# Altium schematic sheet Sch_Add.SchDoc
size A
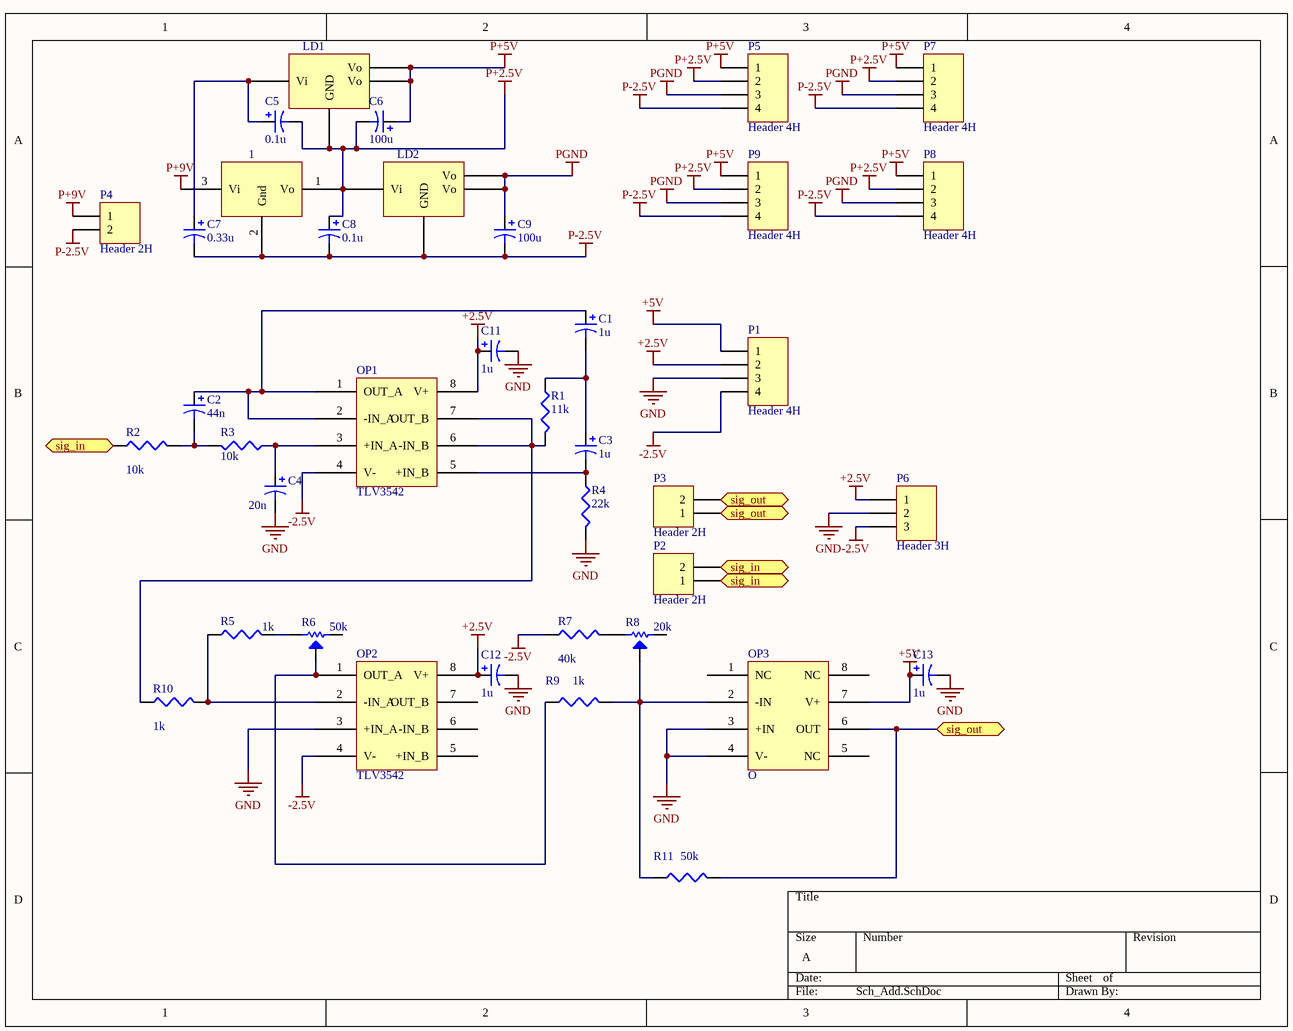
[diagram p0: Sch_Add.SchDoc]

## Parts
1  7805  [TO-92]  (value not drawn)
C1  value 1u  [C0805]  (hidden comment: Cap Pol3)
C2  value 44n  [C0805]  (hidden comment: Cap Pol3)
C3  value 1u  [C0805]  (hidden comment: Cap Pol3)
C4  value 20n  [C0805]  (hidden comment: Cap Pol3)
C5  value 0.1u  [C0805]  (hidden comment: Cap Pol3)
C6  value 100u  [C0805]  (hidden comment: Cap Pol3)
C7  value 0.33u  [C0805]  (hidden comment: Cap Pol3)
C8  value 0.1u  [C0805]  (hidden comment: Cap Pol3)
C9  value 100u  [C0805]  (hidden comment: Cap Pol3)
C11  value 1u  [C0805]  (hidden comment: Cap Pol3)
C12  value 1u  [C0805]  (hidden comment: Cap Pol3)
C13  value 1u  [C0805]  (hidden comment: Cap Pol3)
LD1  LD1117  [SOT230P700X180-4N]  (value not drawn)
LD2  LD1117  [SOT230P700X180-4N]  (value not drawn)
OP1  TLV3542  [SOIC127P600X175-8N]
OP2  TLV3542  [SOIC127P600X175-8N]
OP3  O  [SOIC127P600X175-8N]
P1  Header 4H  [HDR1X4H]
P2  Header 2H  [HDR1X2H]
P3  Header 2H  [HDR1X2H]
P4  Header 2H  [HDR1X2H]
P5  Header 4H  [HDR1X4H]
P6  Header 3H  [HDR1X3H]
P7  Header 4H  [HDR1X4H]
P8  Header 4H  [HDR1X4H]
P9  Header 4H  [HDR1X4H]
R1  value 11k  [J1-0603]  (hidden comment: Res3)
R2  value 10k  [J1-0603]  (hidden comment: Res3)
R3  value 10k  [J1-0603]  (hidden comment: Res3)
R4  value 22k  [J1-0603]  (hidden comment: Res3)
R5  value 1k  [J1-0603]  (hidden comment: Res3)
R6  value 50k  [3362P]  (hidden comment: 5)
R7  value 40k  [J1-0603]  (hidden comment: Res3)
R8  value 20k  [3362P]  (hidden comment: 2)
R9  value 1k  [J1-0603]  (hidden comment: Res3)
R10  value 1k  [J1-0603]  (hidden comment: Res3)
R11  value 50k  [J1-0603]  (hidden comment: Res3)

## Ports
sig_in, sig_out

## Nets
+2.5V: C11.1 C12.1 OP1.8(V+) OP2.8(V+) P1.2 P6.1
+5V: C13.1 OP3.7(V+) P1.1
-2.5V: OP1.4(V-) OP2.4(V-) P1.4 P6.3 R7.1
GND: C4.2 C11.2 C12.2 C13.2 OP2.3(+IN_A) OP3.3(+IN) OP3.4(V-) P1.3 P6.2 R4.2
P+2.5V: 1.1(Vo) C5.2 C6.2 C8.1 LD1.1(GND) LD2.3(Vi) P5.2 P7.2 P8.2 P9.2
P+5V: C6.1 LD1.2(Vo) LD1.4(Vo) P5.1 P7.1 P8.1 P9.1
P+9V: 1.3(Vi) P4.1
P-2.5V: 1.2(Gnd) C7.2 C8.2 C9.2 LD2.1(GND) P4.2 P5.4 P7.4 P8.4 P9.4
PGND: C9.1 LD2.2(Vo) LD2.4(Vo) P5.3 P7.3 P8.3 P9.3
sig_in: P2.1 P2.2 R2.1 ; port sig_in
sig_out: OP3.6(OUT) P3.1 P3.2 R11.2 ; port sig_out
NetC1_1: C1.1 C2.1 OP1.1(OUT_A) OP1.2(-IN_A)
NetC1_2: C1.2 C3.1 R1.1
NetC2_2: C2.2 R2.2 R3.2
NetC3_2: C3.2 OP1.5(+IN_B) R4.1
NetC4_1: C4.1 OP1.3(+IN_A) R3.1
NetC5_1: C5.1 C7.1 LD1.3(Vi)
NetOP1_6: OP1.6(-IN_B) OP1.7(OUT_B) R1.2 R10.1
NetOP2_1: OP2.1(OUT_A) R6.3 R9.1
NetOP2_2: OP2.2(-IN_A) R5.1 R10.2
NetOP3_2: OP3.2(-IN) R8.3 R9.2 R11.1
NetR5_2: R5.2 R6.1
NetR7_2: R7.2 R8.1

Not connected (* = marked no-connect by the designer): OP2 5(+IN_B) 6(-IN_B) 7(OUT_B); OP3 1(NC) 5(NC) 8(NC); R6 2; R8 2

## Library data of the parts
C1-C9 C11-C13 = Cap Pol3: Polarized Capacitor (Surface Mount); Published: 8-Jun-2000; LatestRevisionDate: 29-May-2009; LatestRevisionNote: IPC-7351 Footprint Added.; PackageReference: C0805; Publisher: Altium Limited; PackageDescription: Chip Capacitor
OP3 = OPA388IDR
P1 P5 P7-P9 = Header 4H: Header, 4-Pin, Right Angle; LatestRevisionDate: 17-Jul-2002; LatestRevisionNote: Re-released for DXP Platform.; Publisher: Altium Limited
P2-P4 = Header 2H: Header, 2-Pin, Right Angle; LatestRevisionDate: 17-Jul-2002; LatestRevisionNote: Re-released for DXP Platform.; Publisher: Altium Limited
P6 = Header 3H: Header, 3-Pin, Right Angle; LatestRevisionDate: 17-Jul-2002; LatestRevisionNote: Re-released for DXP Platform.; Publisher: Altium Limited
R1-R5 R7 R9-R11 = Res3: Resistor; Published: 8-Jun-2000; LatestRevisionDate: 29-May-2009; LatestRevisionNote: IPC-7351 Footprint Added.; PackageReference: J1-0603; Publisher: Altium Limited; PackageDescription: Chip Resistor
R6 R8 = Res_3362P